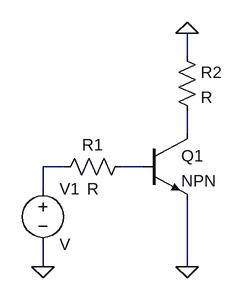
[diagram p0: schematic Schaltung.asc]
Schaltung.asc, the LTspice schematic file:
Version 4
SHEET 1 880 680
WIRE 288 0 288 -32
WIRE 288 112 288 80
WIRE 112 160 80 160
WIRE 224 160 192 160
WIRE 80 192 80 160
WIRE 80 304 80 272
WIRE 288 304 288 208
FLAG 80 304 0
FLAG 288 304 0
FLAG 288 -32 0
SYMBOL voltage 80 176 R0
SYMATTR InstName V1
SYMBOL npn 224 112 R0
SYMATTR InstName Q1
SYMBOL res 208 144 R90
WINDOW 0 0 56 VBottom 2
WINDOW 3 32 56 VTop 2
SYMATTR InstName R1
SYMBOL res 272 -16 R0
SYMATTR InstName R2

The netlist it stands for:
* Schaltung.asc
V1 N002 0 V
Q1 N001 N003 0 0 NPN
R1 N003 N002 R
R2 0 N001 R
.model NPN NPN
.model PNP PNP
.lib standard.bjt
.backanno
.end